# EAGLE design Door-opener (EAGLE 8.1.0)
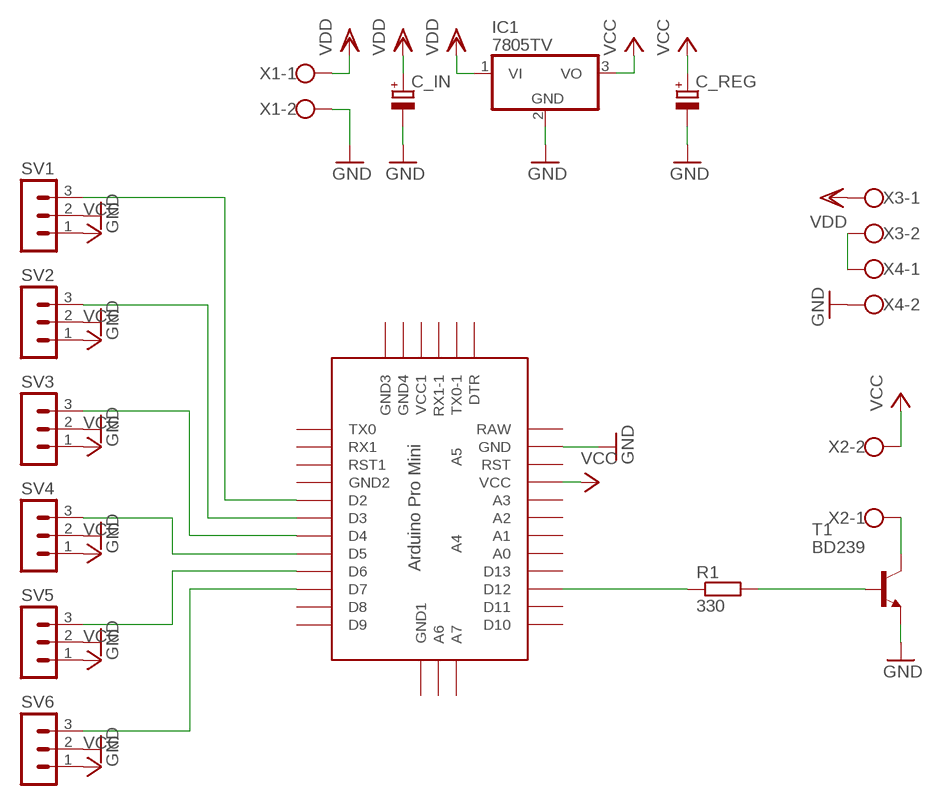
[diagram p0: schematic, sheet 1]

## Parts
C_IN  CPOL-EUE3.5-8  [E3,5-8]
C_REG  CPOL-EUE3.5-8  [E3,5-8]
IC1  7805TV  [TO220V]
R1  330  R-EU_0207/10  [0207/10]
SV1  MA03-1  [MA03-1]
SV2  MA03-1  [MA03-1]
SV3  MA03-1  [MA03-1]
SV4  MA03-1  [MA03-1]
SV5  MA03-1  [MA03-1]
SV6  MA03-1  [MA03-1]
T1  BD239  [TO220]
U$1  ABK-PRO-MINI  [ABK-PRO-MINI]
X1  W237-102  [W237-102]
X2  W237-102  [W237-102]
X3  W237-102  [W237-102]
X4  W237-102  [W237-102]

## Nets
BASE: R1.1 U$1.D12
COLL: T1.2(C) X2.1
GND: C_IN.- C_REG.- IC1.2(GND) SV1.2 SV2.2 SV3.2 SV4.2 SV5.2 SV6.2 T1.3(E) U$1.GND X1.2 X4.2
IN1: SV1.3 U$1.D2
IN2: SV2.3 U$1.D3
IN3: SV3.3 U$1.D4
IN4: SV4.3 U$1.D5
IN5: SV5.3 U$1.D6
IN6: SV6.3 U$1.D7
N$1: R1.2 T1.1(B)
N$2: X3.2 X4.1
VCC: C_REG.+ IC1.3(VO) SV1.1 SV2.1 SV3.1 SV4.1 SV5.1 SV6.1 U$1.VCC X2.2
VDD: C_IN.+ IC1.1(VI) X1.1 X3.1
Unconnected: U$1.A0 U$1.A1 U$1.A2 U$1.A3 U$1.A4 U$1.A5 U$1.A6 U$1.A7 U$1.D8 U$1.D9 U$1.D10 U$1.D11 U$1.D13 U$1.DTR U$1.GND1(GND2) U$1.GND2(GND3) U$1.GND3(GND4) U$1.GND4(GND1) U$1.RAW U$1.RST U$1.RST1 U$1.RX1 U$1.RX1-1 U$1.TX0 U$1.TX0-1 U$1.VCC1

## Library data of the parts
C_IN C_REG = rcl:CPOL-EU: POLARIZED CAPACITOR, European symbol
IC1 = linear:78*: Positive VOLTAGE REGULATOR Source: http://cache.national.com/ds/LM/LM78L05.pdf http://www.fairchildsemi.com/ds/LM/LM7805.pdf
R1 = rcl:R-EU_: RESISTOR, European symbol
SV1-SV6 = con-lstb:MA03-1: PIN HEADER; OC_FARNELL: unknown; OC_NEWARK: unknown
T1 = transistor-neu-to92:BD239: NPN TRANSISTOR Source: http://www.fairchildsemi.com/ds/BD/BD239C.pdf
U$1 = Arduino-clone:ABK-PRO-MINI: ABK Pro-Mini Arduino Clone
X1-X4 = con-wago-500:W237-102: WAGO SCREW CLAMP; MPN: 237-102; OC_FARNELL: unknown; OC_NEWARK: 70K9898

## Board
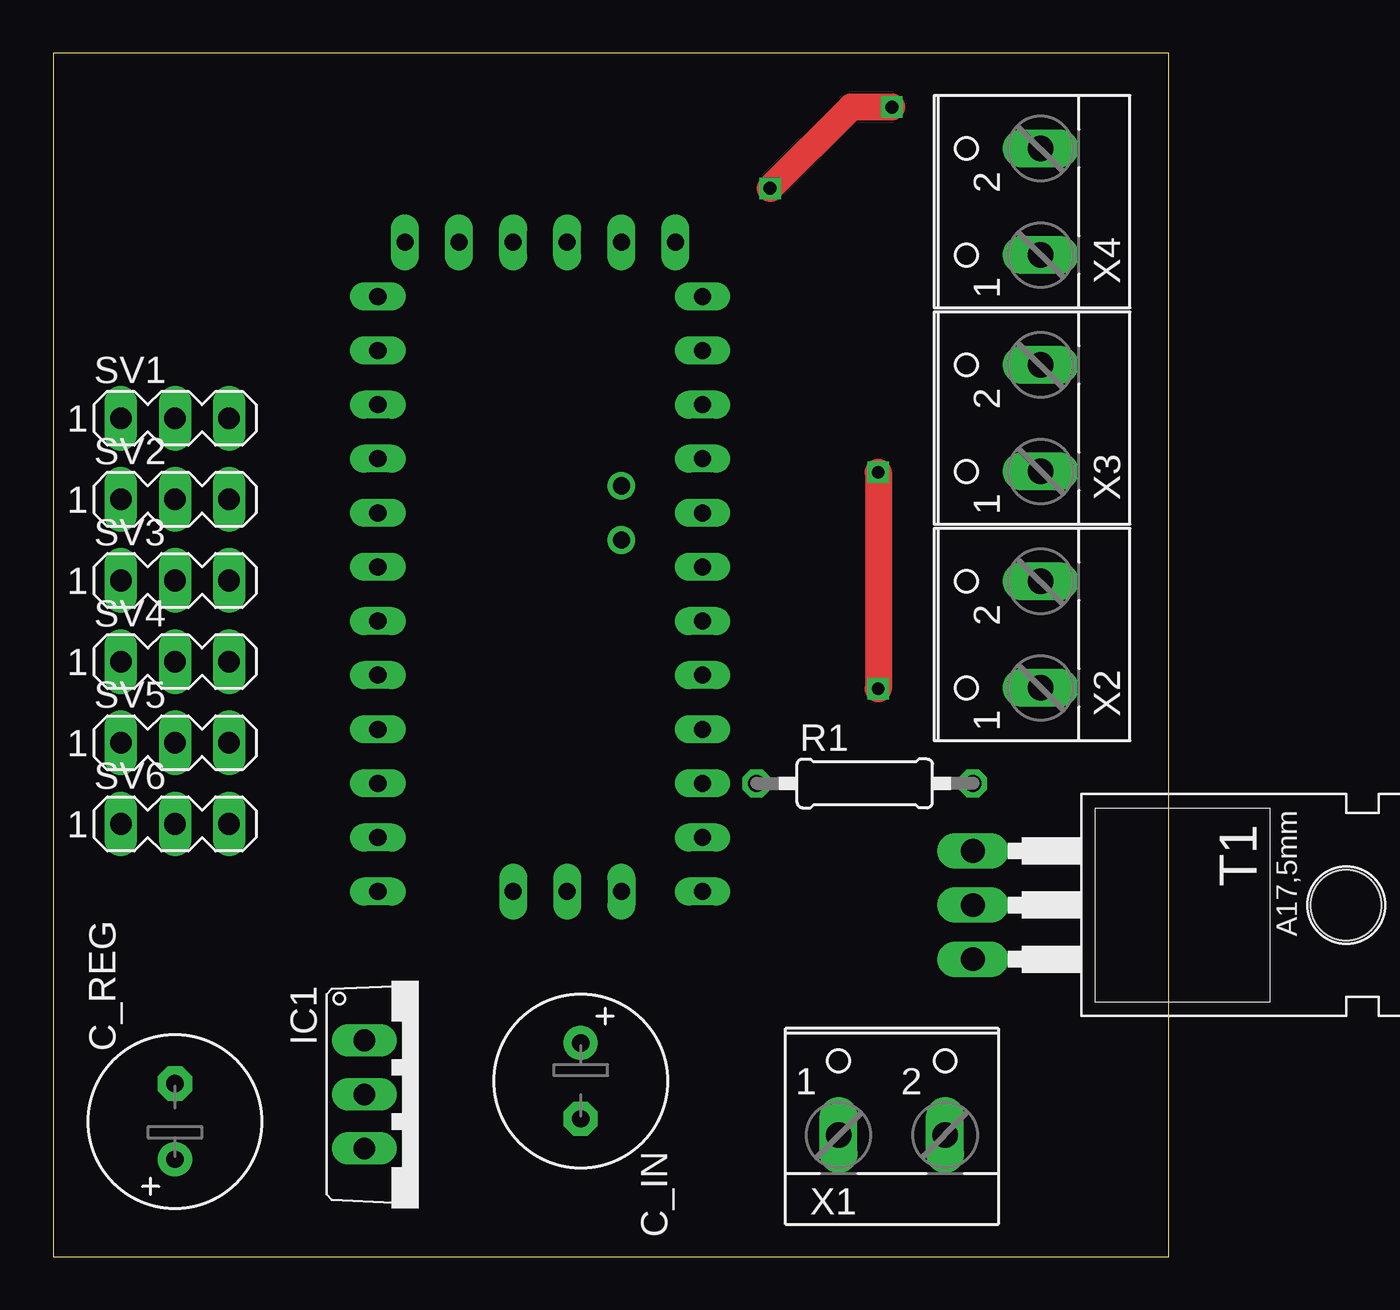
[diagram p1: board, top side]
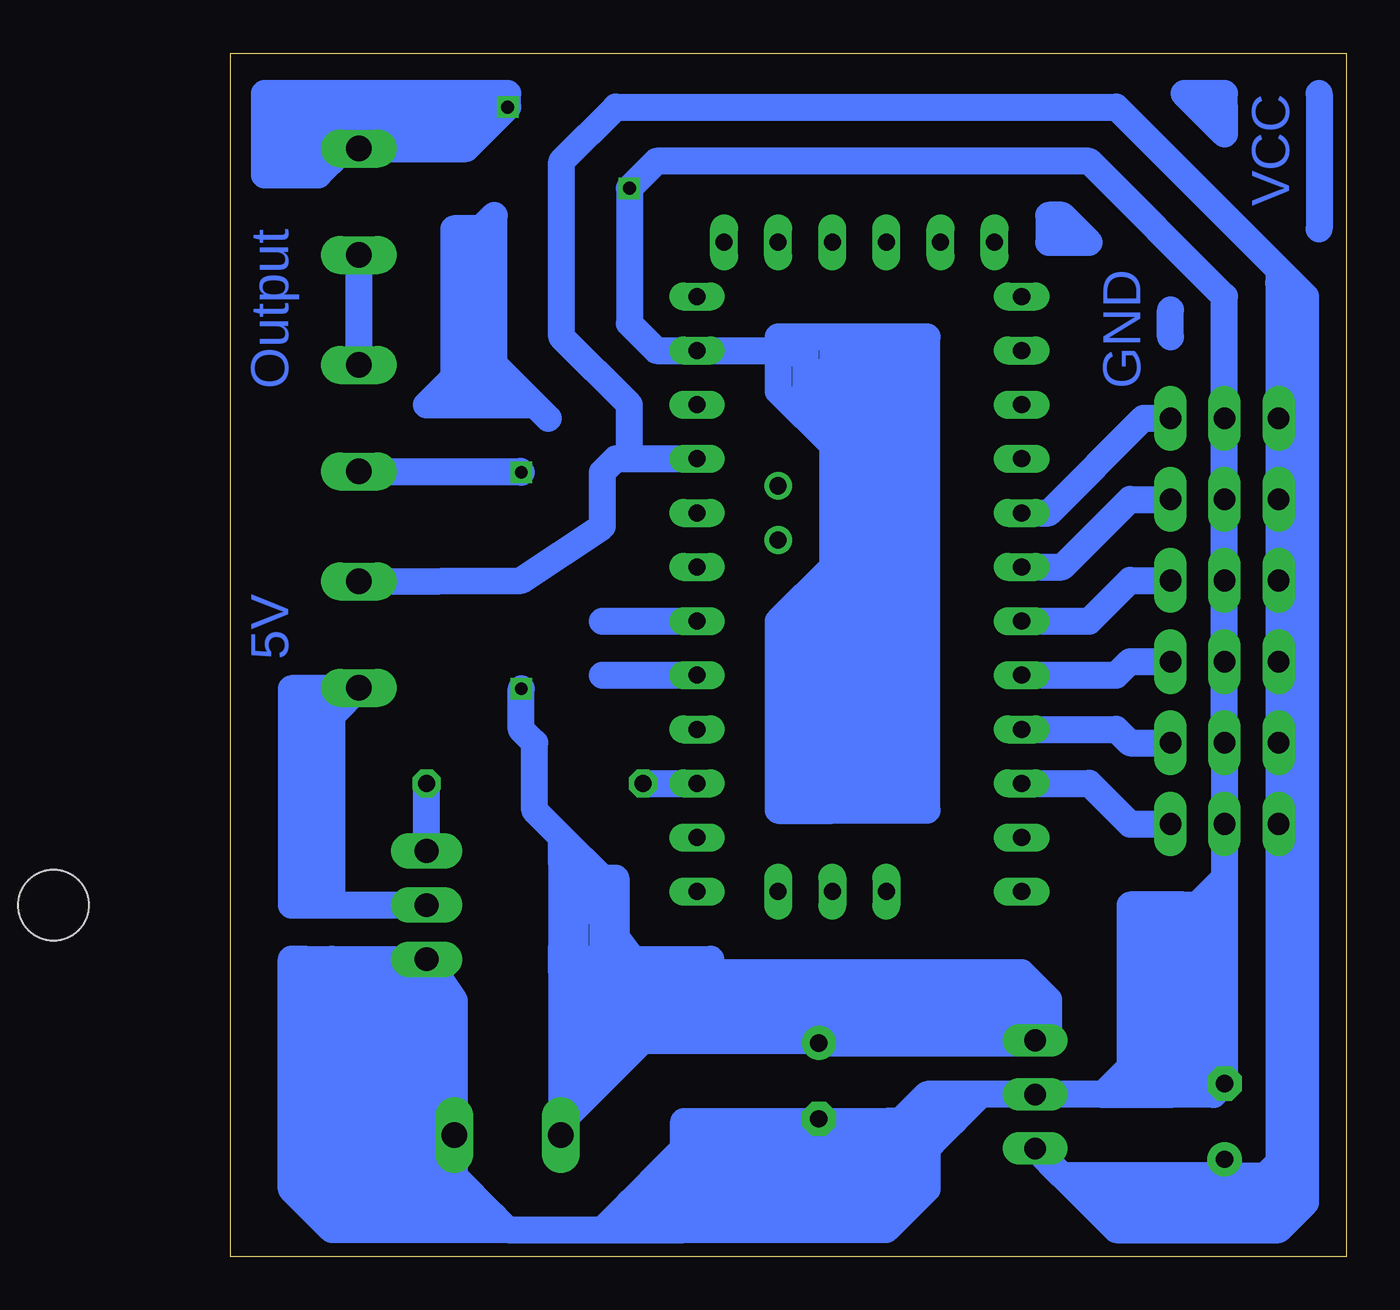
[diagram p2: board, bottom side, seen from below]

Size 52.38 x 56.51 mm. Coordinates in mm from the lower left corner, seen from the top.
Outline: 0,0 52.38,0 52.38,56.51 0,56.51 0,0
Copper layers (1*16): Top 0.035mm / dielectric 1.5mm / Bottom 0.035mm
Design rules "default": minimum track width 10mil, minimum drill 24mil, track to track 8mil, track to pad 8mil, pad to pad 8mil, via to via 8mil, smd to smd 8mil, copper to edge 40mil, drill to drill 8mil, minimum pad ring 10mil, minimum via ring 8mil, stop-mask expansion 4mil, vias tented up to drill 0mil, thermal gap 10mil

### Footprints (pad centres in the part's own frame; a part is rotated, then mirrored left to right if it is on the bottom)
E3,5-8 = drill 0.813 pad 1.6: + -1.778,0 | drill 0.813 pad 1.6 octagon: - 1.778,0
TO220V = drill 1.016 long: 1 -2.54,-2.54; 2 0,-2.54; 3 2.54,-2.54
0207/10 = drill 0.813 octagon: 1 -5.08,0; 2 5.08,0
MA03-1 = drill 1.016 long: 1 -2.54,0; 2 0,0; 3 2.54,0
TO220 = drill 1.118 long: 1 -2.54,-6.35; 2 0,-6.35; 3 2.54,-6.35 | hole 3.302: 0,11.176
ABK-PRO-MINI = drill 0.8 long: A0 10.16,-3.81; A1 10.16,-6.35; A2 10.16,-8.89; A3 10.16,-11.43; A6 3.81,-21.59; A7 6.35,-21.59; D2 -5.08,-3.81; D3 -5.08,-6.35; D4 -5.08,-8.89; D5 -5.08,-11.43; D6 -5.08,-13.97; D7 -5.08,-16.51; D8 -5.08,-19.05; D9 -5.08,-21.59; D10 10.16,-21.59; D11 10.16,-19.05; D12 10.16,-16.51; D13 10.16,-13.97; DTR 8.89,8.89; GND 10.16,3.81; GND1 -5.08,-1.27; GND2 -3.81,8.89; GND3 -1.27,8.89; GND4 1.27,-21.59; RAW 10.16,6.35; RST 10.16,1.27; RST1 -5.08,1.27; RX1 -5.08,3.81; RX1-1 3.81,8.89; TX0 -5.08,6.35; TX0-1 6.35,8.89; VCC 10.16,-1.27; VCC1 1.27,8.89 | drill 0.8: A4 6.35,-5.08; A5 6.35,-2.54
W237-102 = drill 1.194 long: 1 -2.5,-1.27; 2 2.5,-1.27

### Placement (x,y rotation side)
C_IN  24.77,8.26 270 top
C_REG  5.71,6.35 90 top
IC1  17.14,7.62 270 top
R1  38.1,22.23 0 top
SV1  5.71,39.37 0 top
SV2  5.71,35.56 0 top
SV3  5.71,31.75 0 top
SV4  5.71,27.94 0 top
SV5  5.71,24.13 0 top
SV6  5.71,20.32 0 top
T1  49.53,16.51 270 top
U$1  20.32,38.73 0 top
X1  39.37,6.99 0 top
X2  45.09,29.21 90 top
X3  45.09,39.37 90 top
X4  45.09,49.53 90 top

### Tracks (layer width: path | path; a pad name or v marks a point on that pad's centre or on a via)
BASE
  Bottom 1.27: R1.1 U$1.D12
COLL
  Bottom 1.27: X2.1 47.59,25.44 47.62,25.4 47.62,16.51 | 47.62,16.51 T1.2 | 46.35,26.67 48.26,26.67 | 48.26,26.67 49.53,26.67 49.53,17.14 | 49.53,17.14 49.53,16.51 47.62,16.51 | 47.62,16.51 48.9,17.78 48.9,25.4 48.26,26.04 | 48.26,26.67 48.26,18.41 49.53,17.14
GND  (via drill 0.6)
  Top 1.27: v39.37,53.98 37.47,53.98 v33.66,50.16
  Bottom 1.27: SV5.2 SV3.2 | SV5.2 SV6.2 5.71,17.78 | SV5.2 SV4.2 SV3.2 | SV3.2 SV2.2 SV1.2 5.71,45.09 12.06,51.44 32.38,51.44 v33.66,50.16 33.66,43.81 32.38,42.55 U$1.GND 26.67,42.55 | 40.01,1.91 41.87,3.77 X1.2 41.87,12.03 T1.3 | 40.01,1.91 39.37,1.27 | 39.37,1.27 34.92,1.27 | 34.92,1.27 33.66,1.27 | 33.66,1.27 31.75,1.27 | 27.94,5.08 31.75,1.27 | 8.26,7.62 6.22,7.62 C_REG.- 5.71,17.78 | 11.43,7.62 IC1.2 17.14,7.62 | 17.14,7.62 18.41,7.62 | 18.41,7.62 19.68,7.62 20.95,6.35 | 20.95,6.35 22.23,5.08 24.77,5.08 | 24.77,5.08 27.94,5.08 | C_IN.- 24.77,5.08 | 10.16,8.89 7.62,11.43 7.62,16.51 | 7.62,16.51 6.99,16.51 5.71,17.78 | 7.62,16.51 10.16,16.51 10.16,8.89 | 10.16,8.89 11.43,7.62 | 11.43,7.62 8.26,7.62 | 8.26,7.62 6.35,9.53 | 6.35,9.53 6.35,16.51 | 6.35,9.53 6.35,8.89 6.99,8.26 | 33.66,1.27 33.66,1.91 | 33.66,1.91 33.66,2.54 31.11,5.08 31.11,6.35 21.59,6.35 | 20.95,6.35 21.59,6.35 | 21.59,6.35 22.23,5.71 29.21,5.71 | 29.21,5.71 29.84,5.71 30.48,5.08 29.21,5.08 | 27.94,5.08 29.21,5.08 | 29.21,5.08 32.38,1.91 33.02,1.91 | 33.66,1.91 33.02,1.91 | 33.02,1.91 30.48,4.45 | 30.48,4.45 29.21,5.71 | 19.68,5.71 19.68,6.35 | 19.68,6.35 19.68,6.99 | 19.68,5.71 19.68,3.17 21.59,1.27 31.11,1.27 | 31.75,1.27 31.11,1.27 | 31.11,1.27 27.94,4.45 21.59,4.45 | 20.32,4.45 21.59,4.45 | 20.32,4.45 20.32,5.71 20.95,5.08 20.95,2.54 21.59,1.91 21.59,4.45 | 24.13,43.18 19.68,43.18 19.68,20.95 24.13,20.95 | 24.13,43.18 25.4,43.18 | 25.4,43.18 26.67,43.18 26.67,42.55 | 26.67,42.55 26.67,40.64 24.13,38.1 | 24.13,38.1 24.13,32.38 | 24.13,32.38 26.67,29.84 26.67,20.95 24.13,20.95 | 24.13,20.95 24.13,29.21 | 24.13,29.21 24.13,31.75 | 24.13,32.38 24.13,31.75 | 24.13,31.75 26.04,29.84 24.77,29.84 24.13,29.21
  Bottom 1.27: 24.13,39.37 24.13,41.27 | 24.13,43.18 24.13,41.27 | 24.13,41.27 24.77,40.64 24.77,41.27 25.4,41.91 | 25.4,41.91 25.4,43.18 | 25.4,41.91 25.4,40.64 24.13,39.37 | 24.13,39.37 24.13,38.1 | 39.37,1.27 45.09,1.27 | 45.09,1.27 47.62,3.81 47.62,13.97 | 47.62,13.97 T1.3 | T1.3 41.91,4.45 | 41.91,4.45 41.91,1.91 40.01,1.91 | 41.91,4.45 46.99,4.45 44.45,1.91 42.55,1.91 42.55,3.17 43.18,3.81 45.09,3.81 | 45.72,3.81 45.09,3.81 | 45.09,3.81 43.81,2.54 43.18,3.17 | 34.92,1.27 30.48,5.71 30.48,4.45 | X4.2 41.31,52.03 v39.37,53.98 39.37,54.61 50.8,54.61 50.8,50.8 48.26,50.8 47.62,51.44 47.62,52.7 41.91,52.7 40.64,53.98 49.53,53.98 | 18.41,7.62 18.41,6.99 19.68,5.71 | 19.68,6.35 18.41,6.35 | 18.41,6.35 17.14,7.62 | 18.41,6.35 20.32,4.45 | 45.09,1.27 47.62,1.27 49.53,3.17 49.53,13.97 48.9,13.97 | 46.35,1.91 46.99,1.91 48.9,3.81 48.9,13.97 | 48.9,13.97 47.62,13.97 | 49.53,53.98 50.16,53.98 50.16,51.44 48.26,51.44 48.26,53.34 48.9,53.34 48.9,52.07 49.53,52.07 49.53,53.34 | 49.53,53.98 49.53,53.34 | 49.53,53.34 40.64,53.34
IN1
  Bottom 1.27: U$1.D2 13.97,34.92 9.53,39.37 SV1.3
IN2
  Bottom 1.27: U$1.D3 13.34,32.38 10.16,35.56 SV2.3
IN3
  Bottom 1.27: U$1.D4 12.06,29.84 10.16,31.75 SV3.3
IN4
  Bottom 1.27: U$1.D5 10.79,27.3 10.16,27.94 SV4.3
IN5
  Bottom 1.27: U$1.D6 10.79,24.77 10.16,24.13 SV5.3
IN6
  Bottom 1.27: U$1.D7 12.06,22.23 10.16,20.32 SV6.3
N$1
  Bottom 1.27: T1.1 R1.2
N$2
  Bottom 1.27: X3.2 X4.1
N$3
  Bottom 1.27: 38.1,40.01 38.73,40.64 | 38.73,40.64 40.01,41.91 40.01,48.9 40.64,48.26 41.91,48.26 41.91,41.27 43.18,40.01 40.64,40.01 | 40.64,40.01 38.1,40.01 | 38.1,40.01 37.47,39.37 | 38.73,40.64 40.64,40.64 | 41.91,40.64 40.64,40.64 | 40.64,40.64 40.64,47.62 41.27,47.62 41.27,40.64 40.64,40.01
N$6
  Bottom 1.27: 6.99,9.53 6.99,10.79 | 6.99,15.88 6.99,10.79 | 6.99,10.79 7.62,10.16
N$9
  Bottom 1.27: 6.99,53.98 5.71,53.98 | 5.71,53.98 5.71,52.7 6.99,53.98 | 5.71,53.98 5.71,54.61 7.62,54.61 6.99,53.98
N$10
  Bottom 1.27: 1.27,54.61 1.27,48.26
N$12
  Bottom 1.27: 8.26,43.18 8.26,44.45
N$13
  Bottom 1.27: 12.06,47.62 13.34,48.9 13.97,48.9 13.97,47.62 12.06,47.62
N$22
  Bottom 1.27: 34.92,29.84 31.11,29.84
N$23
  Bottom 1.27: 34.92,27.3 31.11,27.3
VCC
  Bottom 1.27: 33.66,37.47 U$1.VCC | 33.66,37.47 33.66,40.01 36.83,43.18 36.83,51.44 34.29,53.98 10.79,53.98 3.17,46.35 | 3.17,45.72 SV1.1 SV2.1 SV3.1 SV4.1 SV5.1 SV6.1 3.17,4.45 3.81,3.81 5.71,3.81 | IC1.3 13.34,3.81 | 5.71,3.81 13.34,3.81 | C_REG.+ 5.71,3.81 | X2.2 38.73,31.75 34.92,34.29 34.92,36.83 34.29,37.47 33.66,37.47 | 13.34,3.81 10.79,1.27 3.17,1.27 1.91,2.54 1.91,45.09 3.17,46.35 | 3.17,46.35 3.17,45.72 | 3.17,45.72 2.54,45.09 2.54,2.54 3.17,1.91 10.79,1.91 11.43,2.54 | 11.43,2.54 12.06,3.17 3.17,3.17 3.17,2.54 11.43,2.54
VDD  (via drill 0.6)
  Top 1.27: v38.73,36.83 v38.73,26.67
  Bottom 1.27: X1.1 36.87,6.31 33.02,10.16 | 33.02,10.16 24.89,10.16 C_IN.+ 14.73,10.03 IC1.1 | 33.02,10.16 33.02,13.34 36.83,18.41 | X3.1 38.77,36.87 v38.73,36.83 | 36.83,18.41 36.83,19.68 | 36.83,19.68 38.1,20.95 38.1,24.13 38.73,24.77 v38.73,26.67 | 13.97,10.16 13.97,12.06 14.61,12.7 | 14.61,12.7 15.24,13.34 29.84,13.34 | 36.83,13.34 36.83,11.43 | 36.83,11.43 34.29,13.97 | 34.29,13.97 29.84,13.97 29.84,13.34 | 29.84,13.34 36.83,13.34 | 36.83,13.34 36.83,14.61 | 36.83,17.78 34.92,17.78 | 34.92,17.78 34.29,17.78 34.29,13.97 | 34.29,13.97 34.92,13.97 | 34.92,13.97 36.2,13.97 36.2,17.14 34.92,17.14 34.92,13.97 | 14.61,12.7 14.61,10.79 15.88,10.79 15.88,12.7 34.92,12.7 36.83,14.61 | 36.83,11.43 36.83,6.35 | 36.83,5.71 36.83,6.35 | 36.83,6.35 33.02,10.79 36.83,10.79 36.83,7.62 34.29,10.16 36.2,10.16 36.2,8.89 | 36.83,18.41 36.83,17.78 | 36.83,17.78 36.83,14.61 | 36.83,19.68 34.92,17.78
(copper drawn outside any net)
  shapes: Bottom area x7

### Text on the board
Bottom: VCC | Output | GND | 5V